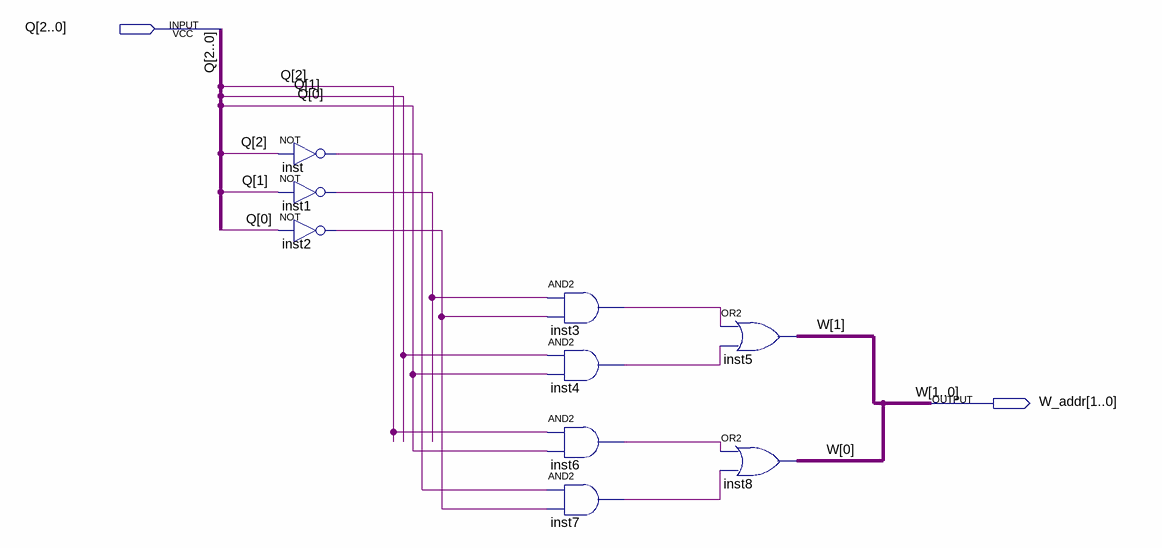
[diagram p0: schematic sheet]
// Quartus schematic W_addr.bdf as structural Verilog: 9 symbols, 2 pins
module W_addr (
  input  [2:0] Q,
  output [1:0] W_addr
);

  wire inst1_out, inst2_out, inst3_out, inst4_out, inst6_out, inst7_out, inst_out;

  not inst (inst_out, Q[2]);
  not inst1 (inst1_out, Q[1]);
  not inst2 (inst2_out, Q[0]);
  and inst3 (inst3_out, inst1_out, inst2_out);
  and inst4 (inst4_out, Q[1], Q[0]);
  and inst6 (inst6_out, Q[2], Q[0]);
  and inst7 (inst7_out, inst_out, inst2_out);
  or inst5 (W_addr[1], inst3_out, inst4_out);
  or inst8 (W_addr[0], inst6_out, inst7_out);

  // Other names for the same wires on the sheet: W[1:0] = W_addr
endmodule
